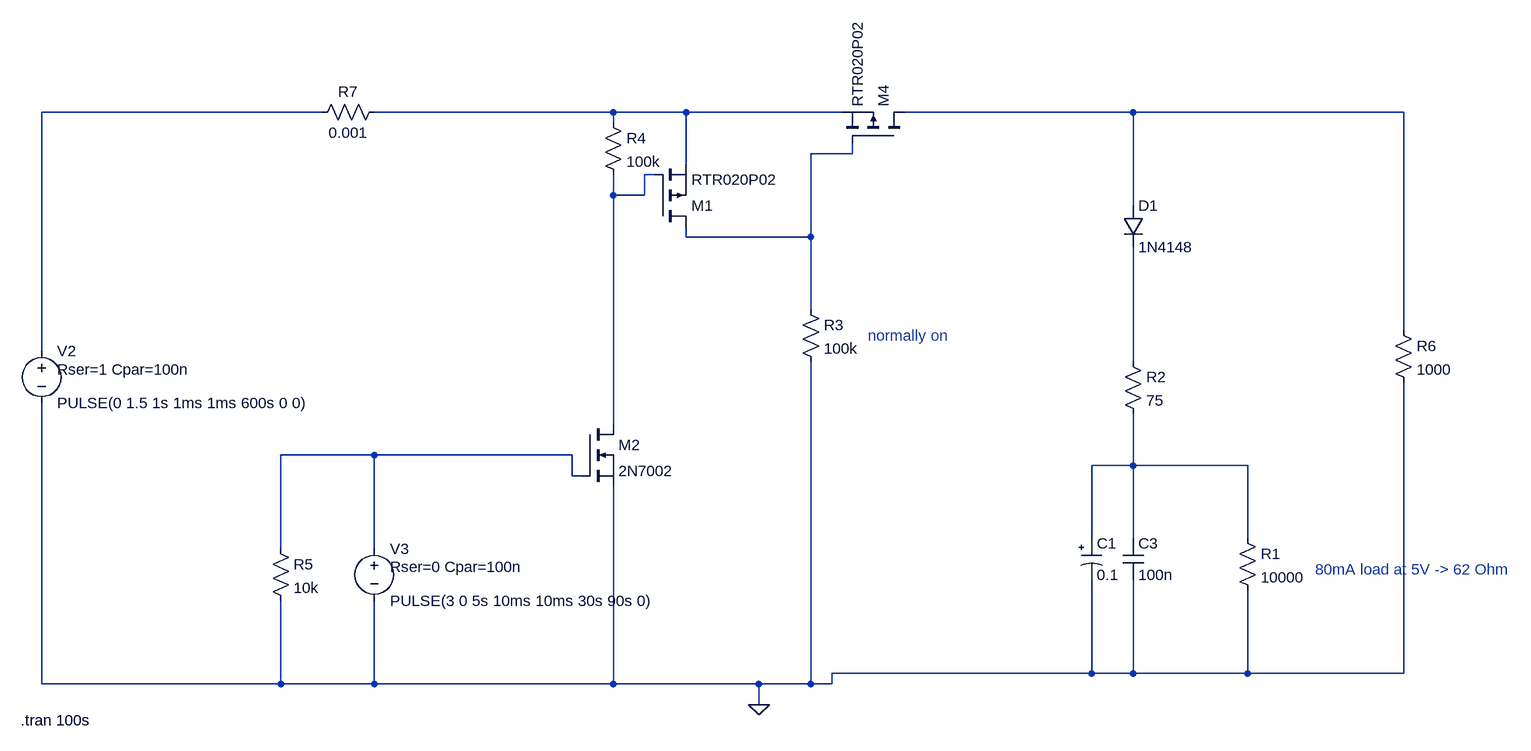
[diagram p0: schematic supercap_normally_on.asc]
supercap_normally_on.asc, the LTspice schematic file:
Version 4
SHEET 1 1864 680
WIRE -752 -480 -1184 -480
WIRE -304 -480 -672 -480
WIRE -192 -480 -304 -480
WIRE 48 -480 -192 -480
WIRE 496 -480 144 -480
WIRE 912 -480 496 -480
WIRE -304 -464 -304 -480
WIRE 64 -416 64 -432
WIRE 64 -416 0 -416
WIRE -192 -400 -192 -480
WIRE -240 -384 -256 -384
WIRE -304 -352 -304 -384
WIRE -256 -352 -256 -384
WIRE -256 -352 -304 -352
WIRE 496 -336 496 -480
WIRE -192 -288 -192 -304
WIRE 0 -288 0 -416
WIRE 0 -288 -192 -288
WIRE 0 -176 0 -288
WIRE 912 -144 912 -480
WIRE -1184 -112 -1184 -480
WIRE 496 -96 496 -272
WIRE -304 0 -304 -352
WIRE -672 48 -816 48
WIRE -368 48 -672 48
WIRE 496 64 496 -16
WIRE 496 64 432 64
WIRE 672 64 496 64
WIRE -368 80 -368 48
WIRE -352 80 -368 80
WIRE 432 176 432 64
WIRE 496 176 496 64
WIRE 672 176 672 64
WIRE -816 192 -816 48
WIRE -672 192 -672 48
WIRE 432 384 432 240
WIRE 432 384 32 384
WIRE 496 384 496 240
WIRE 496 384 432 384
WIRE 672 384 672 256
WIRE 672 384 496 384
WIRE 912 384 912 -64
WIRE 912 384 672 384
WIRE -1184 400 -1184 -32
WIRE -816 400 -816 272
WIRE -816 400 -1184 400
WIRE -672 400 -672 272
WIRE -672 400 -816 400
WIRE -304 400 -304 96
WIRE -304 400 -672 400
WIRE -80 400 -304 400
WIRE 0 400 0 -96
WIRE 0 400 -80 400
WIRE 32 400 32 384
WIRE 32 400 0 400
WIRE -80 432 -80 400
FLAG -80 432 0
SYMBOL voltage -1184 -128 R0
WINDOW 123 0 0 Left 0
WINDOW 39 24 44 Left 2
SYMATTR SpiceLine Rser=1 Cpar=100n
SYMATTR InstName V2
SYMATTR Value PULSE(0 1.5 1s 1ms 1ms 600s 0 0)
SYMBOL res 656 160 R0
SYMATTR InstName R1
SYMATTR Value 10000
SYMBOL cap 480 176 R0
SYMATTR InstName C3
SYMATTR Value 100n
SYMBOL pmos 144 -432 M270
SYMATTR InstName M4
SYMATTR Value RTR020P02
SYMBOL voltage -672 176 R0
WINDOW 123 0 0 Left 0
WINDOW 39 24 44 Left 2
SYMATTR SpiceLine Rser=0 Cpar=100n
SYMATTR InstName V3
SYMATTR Value PULSE(3 0 5s 10ms 10ms 30s 90s 0)
SYMBOL res -16 -192 R0
SYMATTR InstName R3
SYMATTR Value 100k
SYMBOL polcap 416 176 R0
WINDOW 3 24 56 Left 2
SYMATTR Value 0.1
SYMATTR InstName C1
SYMATTR Description Capacitor
SYMATTR Type cap
SYMATTR SpiceLine V=5.5 Irms=2.86 Rser=75 Lser=0
SYMBOL res 480 -112 R0
SYMATTR InstName R2
SYMATTR Value 75
SYMBOL res -320 -480 R0
SYMATTR InstName R4
SYMATTR Value 100k
SYMBOL res -832 176 R0
SYMATTR InstName R5
SYMATTR Value 10k
SYMBOL pmos -240 -304 M180
SYMATTR InstName M1
SYMATTR Value RTR020P02
SYMBOL nmos -352 0 R0
SYMATTR InstName M2
SYMATTR Value 2N7002
SYMBOL diode 480 -336 R0
SYMATTR InstName D1
SYMATTR Value 1N4148
SYMBOL res 896 -160 R0
SYMATTR InstName R6
SYMATTR Value 1000
SYMBOL res -656 -496 R90
WINDOW 0 0 56 VBottom 2
WINDOW 3 32 56 VTop 2
SYMATTR InstName R7
SYMATTR Value 0.001
TEXT -1216 456 Left 2 !.tran 100s
TEXT 776 224 Left 2 ;80mA load at 5V -> 62 Ohm
TEXT 88 -136 Left 2 ;normally on

The netlist it stands for:
* supercap_normally_on.asc
V2 N001 0 PULSE(0 1.5 1s 1ms 1ms 600s 0 0) Rser=1 Cpar=100n
R1 N008 0 10000
C3 N008 0 100n
M4 N003 N004 N002 N002 RTR020P02
V3 N007 0 PULSE(3 0 5s 10ms 10ms 30s 90s 0) Rser=0 Cpar=100n
R3 N004 0 100k
C1 N008 0 0.1 V=5.5 Irms=2.86 Rser=75 Lser=0
R2 N006 N008 75
R4 N002 N005 100k
R5 N007 0 10k
M1 N004 N005 N002 N002 RTR020P02
M2 N005 N007 0 0 2N7002
D1 N003 N006 1N4148
R6 N003 0 1000
R7 N002 N001 0.001
.model D D
.lib standard.dio
.model NMOS NMOS
.model PMOS PMOS
.lib standard.mos
.tran 100s
* 80mA load at 5V -> 62 Ohm
* normally on
.backanno
.end